# EAGLE design drive_pdu (EAGLE 9.1.3)
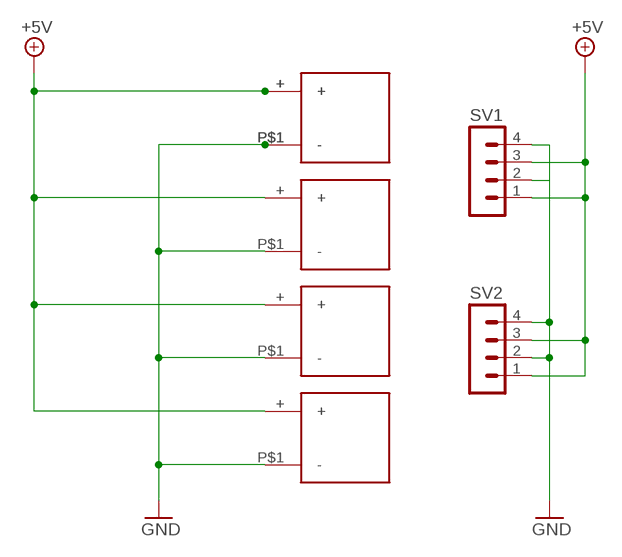
[diagram p0: schematic, sheet 1]

## Parts
SV1  MA04-1  [MA04-1]
SV2  MA04-1  [MA04-1]
U$1  PP45-DG  [PP45-DG]
U$2  PP45-DG  [PP45-DG]
U$3  PP45-DG  [PP45-DG]
U$4  PP45-DG  [PP45-DG]
U$5  PP45-DG  [PP45-DG]

## Nets
+5V: SV1.1 SV1.3 SV2.1 SV2.3 U$1.+ U$2.+ U$3.+ U$4.+ U$5.+
GND: SV1.2 SV1.4 SV2.2 SV2.4 U$1.P$1(-) U$2.P$1(-) U$3.P$1(-) U$4.P$1(-) U$5.P$1(-)

## Library data of the parts
SV1 SV2 = con-lstb:MA04-1: PIN HEADER; OC_FARNELL: unknown; OC_NEWARK: unknown
U$1-U$5 = SPEAR:PP45-DG

## Board
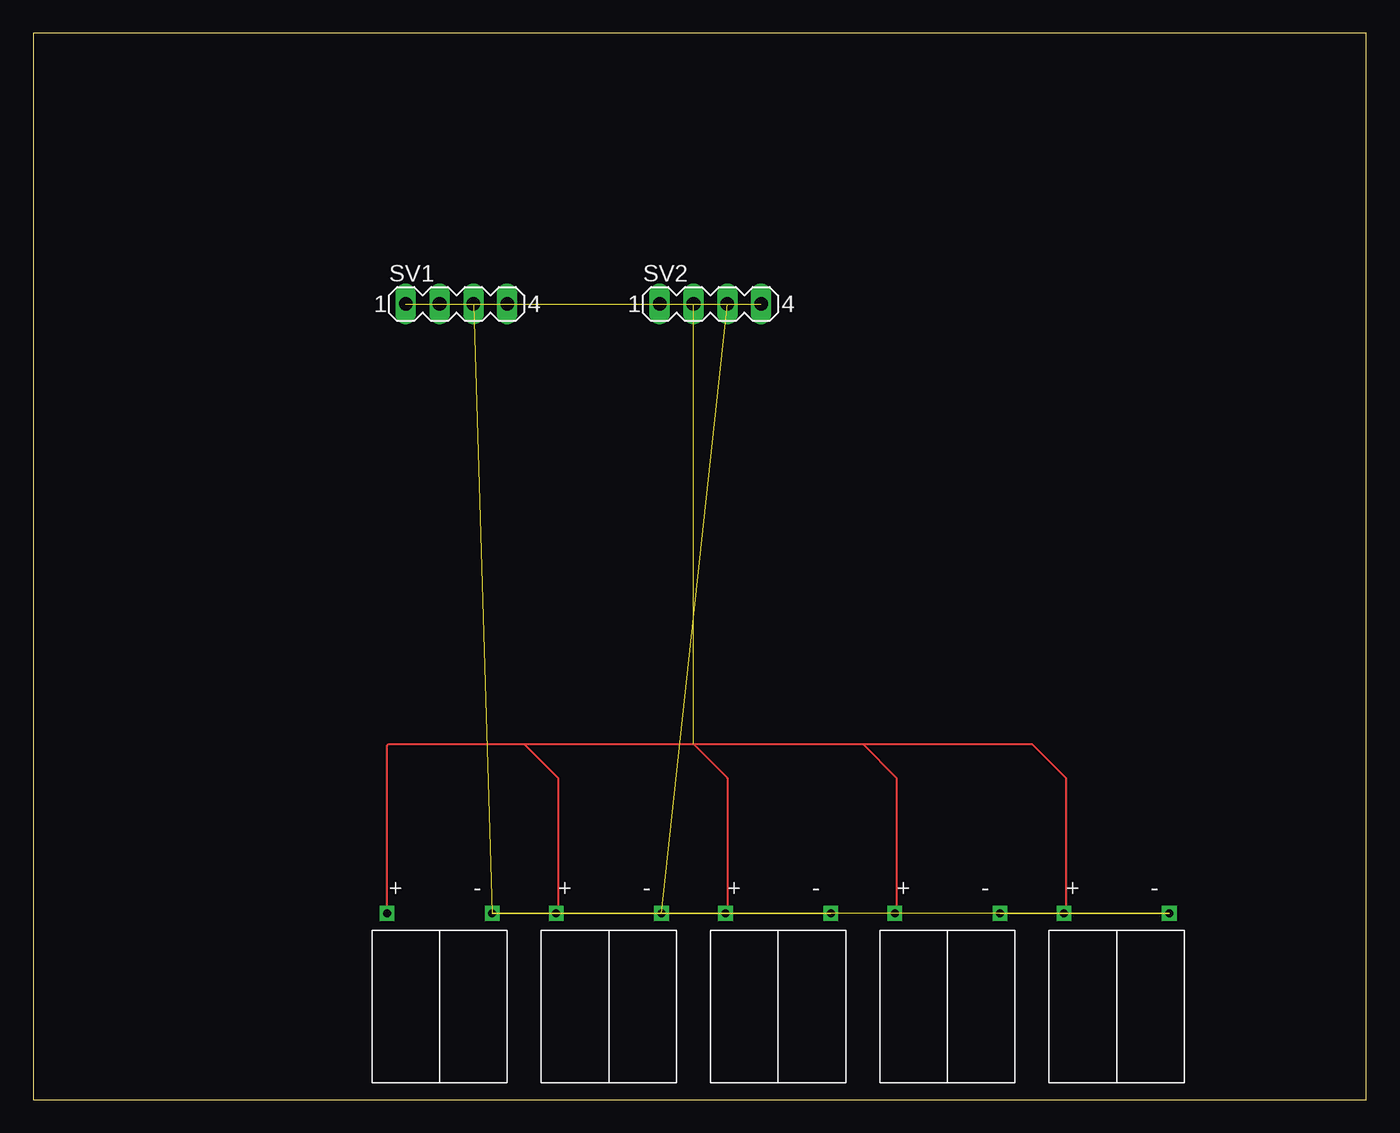
[diagram p1: board, top side]

Size 100 x 80 mm. Coordinates in mm from the lower left corner, seen from the top.
Outline: 0,0 100,0 100,80 0,80 0,0
Copper layers (1*16): Top 0.035mm / dielectric 1.5mm / Bottom 0.035mm
Design rules "default": minimum track width 6mil, minimum drill 0.35mm, track to track 6mil, track to pad 6mil, pad to pad 6mil, via to via 6mil, smd to smd 6mil, copper to edge 40mil, drill to drill 6mil, minimum pad ring 10mil, minimum via ring 8mil, stop-mask expansion 4mil, vias tented up to drill 0mil, thermal gap 10mil

### Footprints (pad centres in the part's own frame; a part is rotated, then mirrored left to right if it is on the bottom)
MA04-1 = drill 1.016 long: 1 -3.81,0; 2 -1.27,0; 3 1.27,0; 4 3.81,0
PP45-DG = drill 0.6 square: + 3.95,0; P$1 -3.95,0

### Placement (x,y rotation side)
SV1  31.75,59.69 0 top
SV2  50.8,59.69 0 top
U$1  68.58,13.97 0 top
U$2  81.28,13.97 0 top
U$3  55.88,13.97 0 top
U$4  30.48,13.97 0 top
U$5  43.18,13.97 0 top

### Tracks (layer width: path | path; a pad name or v marks a point on that pad's centre or on a via)
+5V  (8 unrouted)
GND  (5 unrouted)
  Top 0.152: U$4.P$1 26.53,26.53 26.67,26.67 36.83,26.67 | 36.83,26.67 39.37,24.13 39.37,14.11 U$5.P$1 | 36.83,26.67 49.53,26.67 | 49.53,26.67 52.07,24.13 52.07,14.11 U$3.P$1 | 49.53,26.67 62.23,26.67 | 62.23,26.67 64.77,24.13 64.77,13.97 U$1.P$1 | 62.23,26.67 | 62.23,26.67 74.93,26.67 77.47,24.13 77.47,13.97